# EAGLE design NodeGeneric.v1.cg2 (EAGLE 4.16)
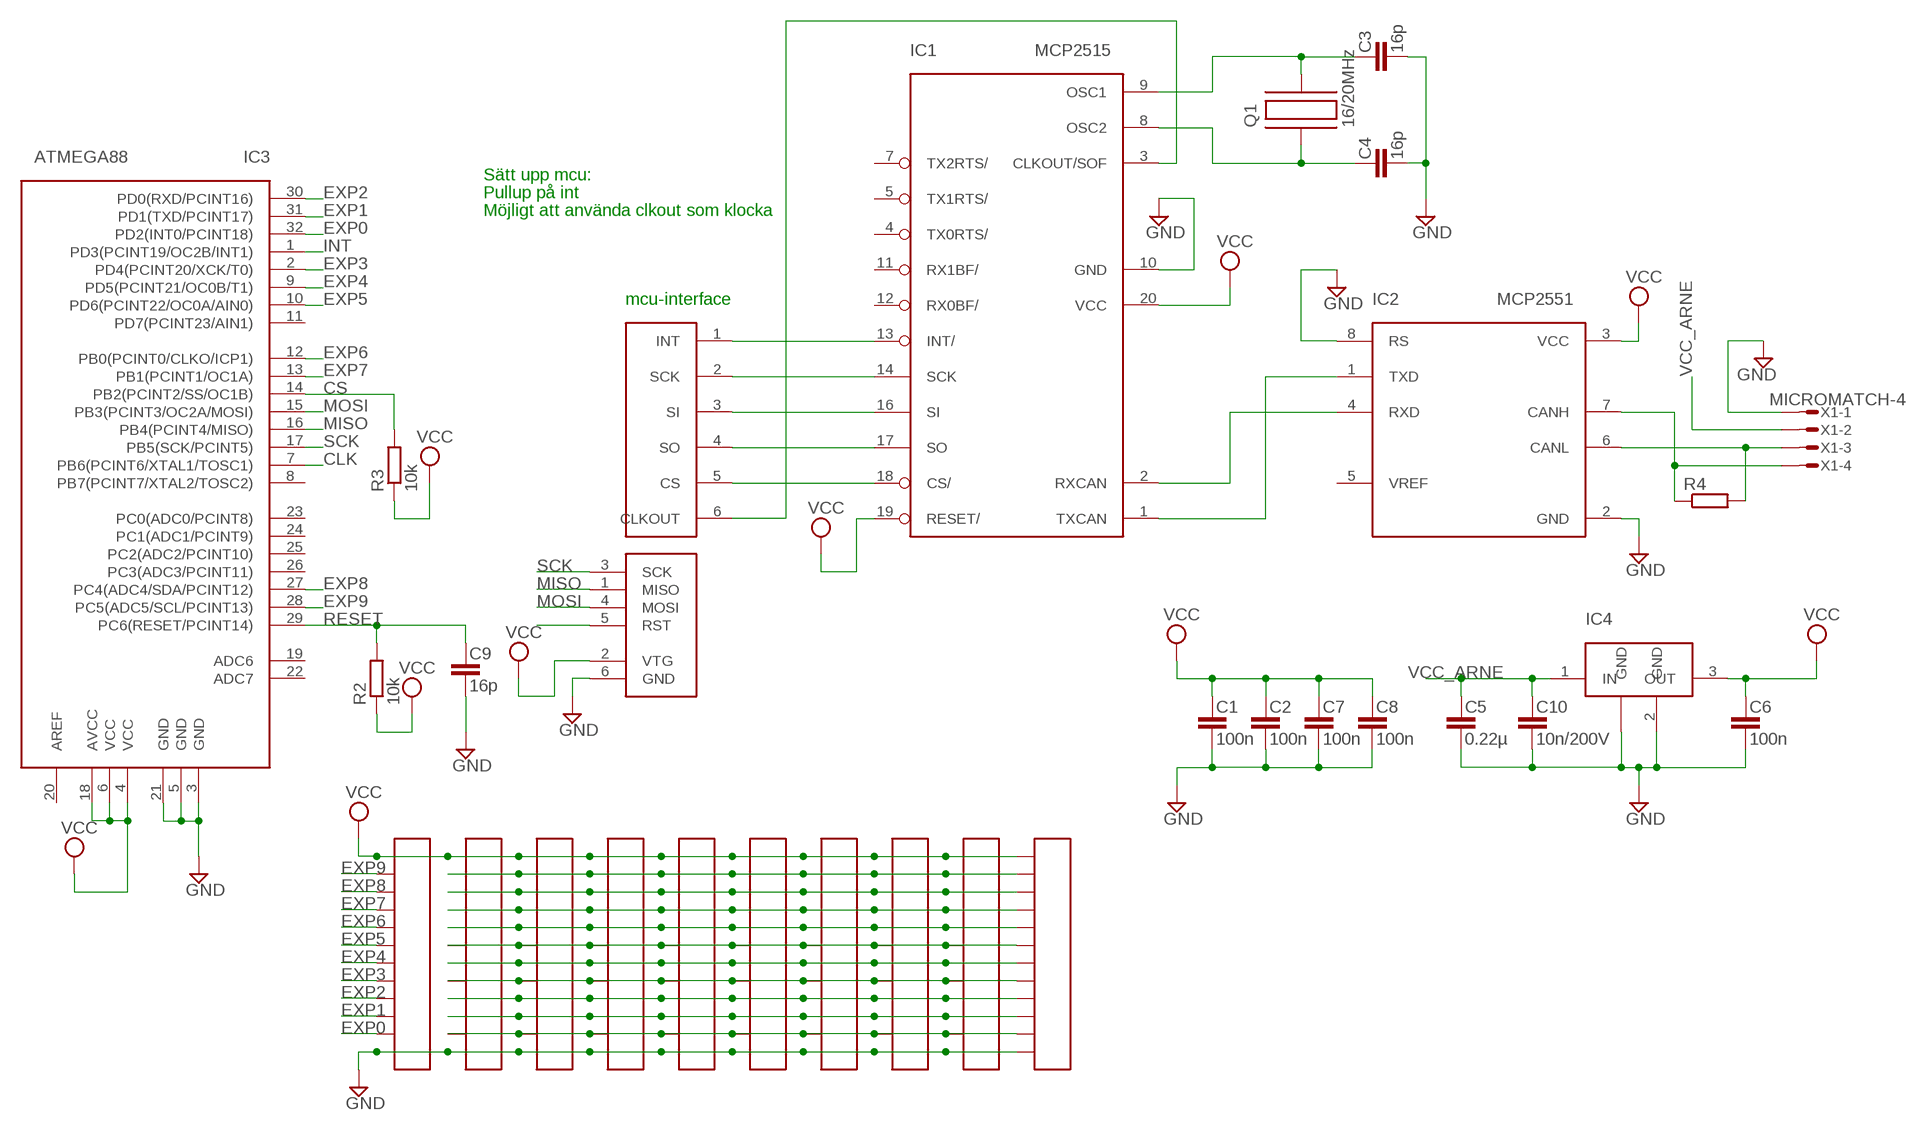
[diagram p0: schematic, sheet 1]

## Parts
C1  100n  C-EU  [C0603]
C2  100n  C-EU  [C0603]
C3  16p  C-EU  [C0603]
C4  16p  C-EU  [C0603]
C5  0.22µ  C-EU  [C0603]
C6  100n  C-EU  [C0603]
C7  100n  C-EU  [C0603]
C8  100n  C-EU  [C0603]
C9  16p  C-EU  [C0603]
C10  10n/200V  C-EU  [C0603]
IC1  MCP2515  [TSSOP]
IC2  MCP2551  [SOIC]
IC3  ATMEGA88  [TQFP32]
IC4  LM340MP-5.0  [SOT223]
Q1  16/20MHz  C-MAC-LFA147E  [SMD]
R2  10k  R-EU_R0603  [R0603@1]
R3  10k  R-EUR0603  [R0603]
R4  R-EUR0603  [R0603]
U$1  CAN-INTERFACE  [VIA-LIST]
U$3  COLUMN  [COLUMN]
U$4  COLUMN  [COLUMN]
U$5  COLUMN  [COLUMN]
U$6  COLUMN  [COLUMN]
U$7  COLUMN  [COLUMN]
U$8  COLUMN  [COLUMN]
U$9  COLUMN  [COLUMN]
U$10  COLUMN  [COLUMN]
U$11  COLUMN  [COLUMN]
U$12  COLUMN  [COLUMN]
X1  MICROMATCH-4  [MICROMATCH-4]
X2  ISP  AVRISP6PIN  [6PIN]

## Nets
CANH: IC2.7(CANH) R4.1 X1.4
CANL: IC2.6(CANL) R4.2 X1.3
CLK: IC1.3(CLKOUT/SOF) IC3.7(PB6(PCINT6/XTAL1/TOSC1)) U$1.6(CLKOUT)
CS: IC1.18(CS/) IC3.14(PB2(PCINT2/SS/OC1B)) R3.2 U$1.5(CS)
EXP0: IC3.32(PD2(INT0/PCINT18)) U$3.11
EXP1: IC3.31(PD1(TXD/PCINT17)) U$3.10
EXP2: IC3.30(PD0(RXD/PCINT16)) U$3.9
EXP3: IC3.2(PD4(PCINT20/XCK/T0)) U$3.8
EXP4: IC3.9(PD5(PCINT21/OC0B/T1)) U$3.7
EXP5: IC3.10(PD6(PCINT22/OC0A/AIN0)) U$3.6
EXP6: IC3.12(PB0(PCINT0/CLKO/ICP1)) U$3.5
EXP7: IC3.13(PB1(PCINT1/OC1A)) U$3.4
EXP8: IC3.27(PC4(ADC4/SDA/PCINT12)) U$3.3
EXP9: IC3.28(PC5(ADC5/SCL/PCINT13)) U$3.2
EXP11: U$4.11 U$5.11 U$6.11 U$7.11 U$8.11 U$9.11 U$10.11 U$11.11 U$12.11
EXP12: U$4.10 U$5.10 U$6.10 U$7.10 U$8.10 U$9.10 U$10.10 U$11.10 U$12.10
EXP13: U$4.9 U$5.9 U$6.9 U$7.9 U$8.9 U$9.9 U$10.9 U$11.9 U$12.9
EXP14: U$4.8 U$5.8 U$6.8 U$7.8 U$8.8 U$9.8 U$10.8 U$11.8 U$12.8
EXP15: U$4.7 U$5.7 U$6.7 U$7.7 U$8.7 U$9.7 U$10.7 U$11.7 U$12.7
EXP16: U$4.6 U$5.6 U$6.6 U$7.6 U$8.6 U$9.6 U$10.6 U$11.6 U$12.6
EXP17: U$4.5 U$5.5 U$6.5 U$7.5 U$8.5 U$9.5 U$10.5 U$11.5 U$12.5
EXP18: U$4.4 U$5.4 U$6.4 U$7.4 U$8.4 U$9.4 U$10.4 U$11.4 U$12.4
EXP19: U$4.3 U$5.3 U$6.3 U$7.3 U$8.3 U$9.3 U$10.3 U$11.3 U$12.3
EXP20: U$4.2 U$5.2 U$6.2 U$7.2 U$8.2 U$9.2 U$10.2 U$11.2 U$12.2
GND: C1.2 C2.2 C3.2 C4.2 C5.2 C6.2 C7.2 C8.2 C9.2 C10.2 IC1.10(GND) IC2.2(GND) IC2.8(RS) IC3.3(GND) IC3.5(GND) IC3.21(GND) IC4.2(GND) IC4.4(GND) U$3.12 U$4.12 U$5.12 U$6.12 U$7.12 U$8.12 U$9.12 U$10.12 U$11.12 U$12.12 X1.1 X2.6(GND)
INT: IC1.13(INT/) IC3.1(PD3(PCINT19/OC2B/INT1)) U$1.1(INT)
MISO: IC1.17(SO) IC3.16(PB4(PCINT4/MISO)) U$1.4(SO) X2.1(MISO)
MOSI: IC1.16(SI) IC3.15(PB3(PCINT3/OC2A/MOSI)) U$1.3(SI) X2.4(MOSI)
N$1: IC1.2(RXCAN) IC2.4(RXD)
N$2: IC1.1(TXCAN) IC2.1(TXD)
N$12: C3.1 IC1.9(OSC1) Q1.P$2
N$13: C4.1 IC1.8(OSC2) Q1.P$1
RESET: C9.1 IC3.29(PC6(RESET/PCINT14)) R2.2 X2.5(RST)
SCK: IC1.14(SCK) IC3.17(PB5(SCK/PCINT5)) U$1.2(SCK) X2.3(SCK)
VCC: C1.1 C2.1 C6.1 C7.1 C8.1 IC1.19(RESET/) IC1.20(VCC) IC2.3(VCC) IC3.4(VCC) IC3.6(VCC) IC3.18(AVCC) IC4.3(OUT) R2.1 R3.1 U$3.1 U$4.1 U$5.1 U$6.1 U$7.1 U$8.1 U$9.1 U$10.1 U$11.1 U$12.1 X2.2(VTG)
VCC_ARNE: C5.1 C10.1 IC4.1(IN) X1.2
Unconnected: IC1.4(TX0RTS/) IC1.5(TX1RTS/) IC1.7(TX2RTS/) IC1.11(RX1BF/) IC1.12(RX0BF/) IC2.5(VREF) IC3.8(PB7(PCINT7/XTAL2/TOSC2)) IC3.11(PD7(PCINT23/AIN1)) IC3.19(ADC6) IC3.20(AREF) IC3.22(ADC7) IC3.23(PC0(ADC0/PCINT8)) IC3.24(PC1(ADC1/PCINT9)) IC3.25(PC2(ADC2/PCINT10)) IC3.26(PC3(ADC3/PCINT11))

## Notes on the sheet
- Sätt upp mcu:
- Pullup på int
- Möjligt att använda clkout som klocka
- mcu-interface

## Library data of the parts
C1-C10 = rcl:C-EU
IC1 = mcp2515:MCP2515
IC2 = mcp2551:MCP2551
IC3 = atmega88:ATMEGA88
IC4 = lm340mp:LM340MP-5.0
Q1 = hc49-4h-smx:C-MAC-LFA147E
R2 = rcl:R-EU_: RESISTOR, European symbol
R3 R4 = rcl:R-EU
U$1 = can-interface:CAN-INTERFACE
U$3-U$12 = expboard:COLUMN
X1 = con-amp-micromatch:MICROMATCH-4: MicroMaTch 4 7-215464-4 / 0-215464-4 Drawing Number C-215464 DDEController.pdf
X2 = avrisp:AVRISP6PIN

## Board
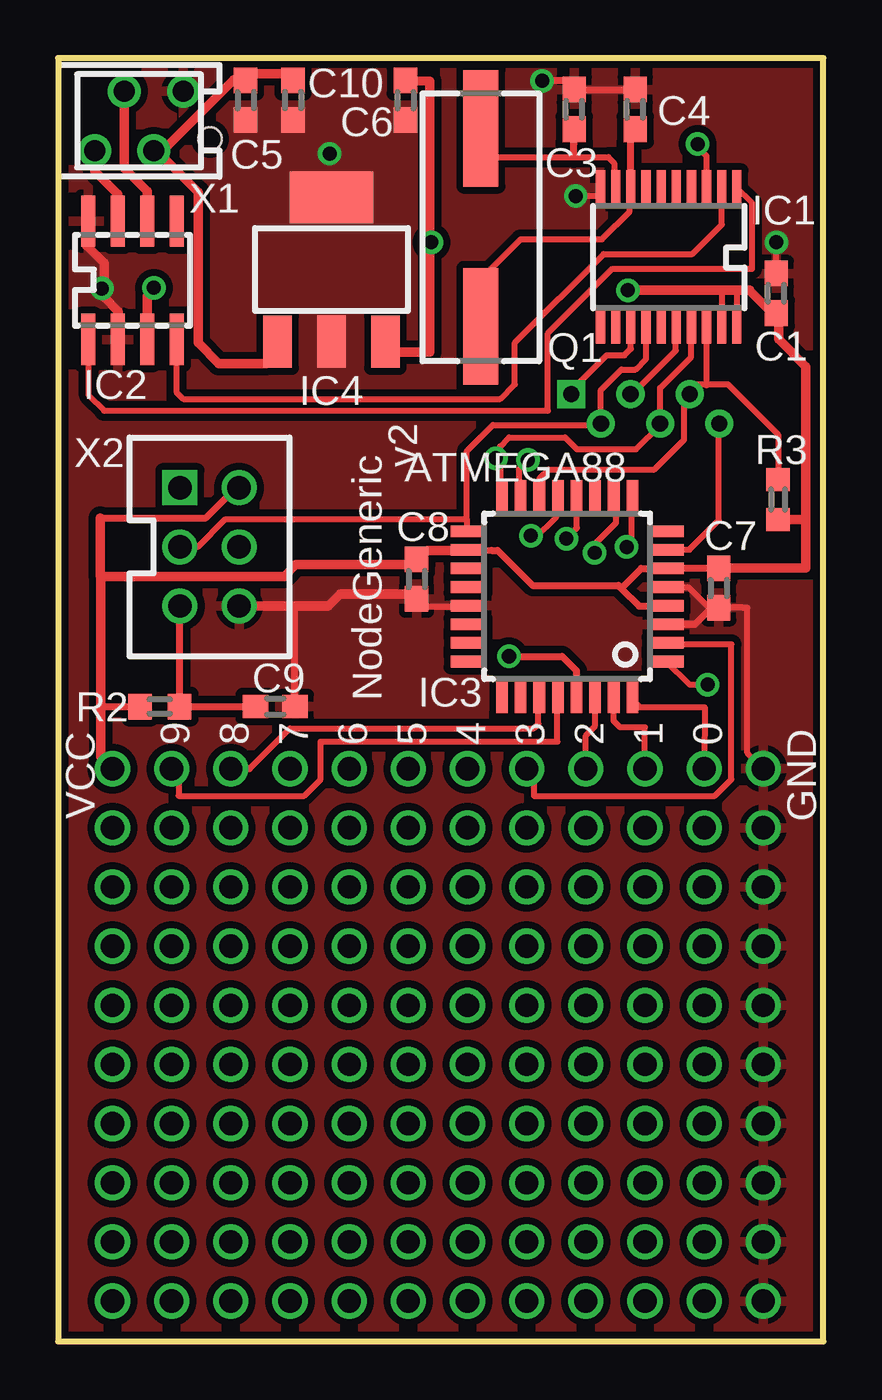
[diagram p1: board, top side]
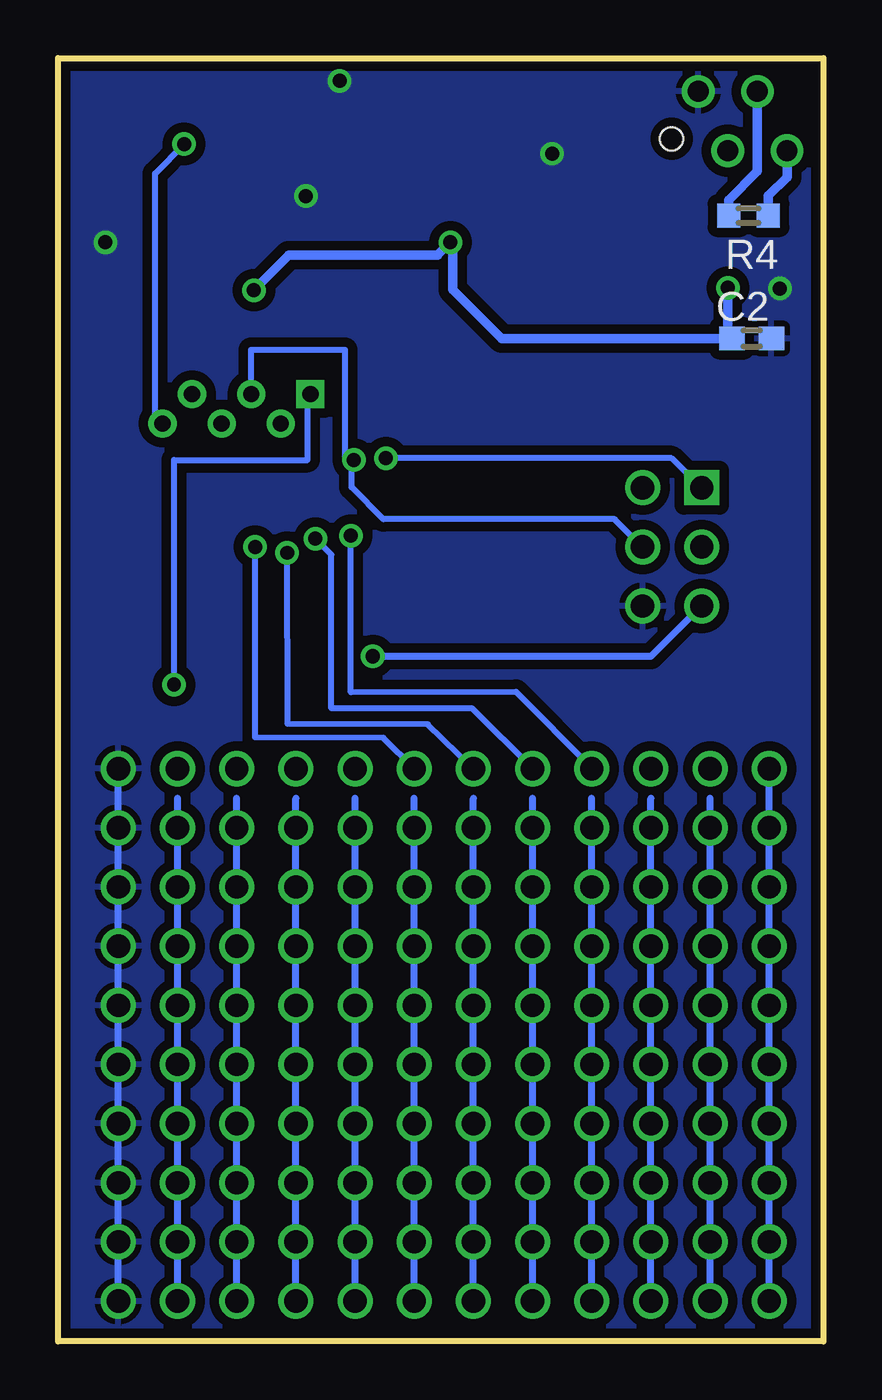
[diagram p2: board, bottom side, seen from below]

Size 32.85 x 55.1 mm. Coordinates in mm from the lower left corner, seen from the top.
Outline: 0,0 32.85,0 32.85,55.1 0,55.1 0,0
Copper layers (1*16): Top 0.035mm / dielectric 1.5mm / Bottom 0.035mm
Design rules "10mils, 0.6drill": minimum track width 10mil, minimum drill 0.6mm, track to track 10mil, track to pad 10mil, pad to pad 10mil, via to via 10mil, smd to smd 10mil, copper to edge 10mil, drill to drill 10mil, minimum pad ring 10mil, minimum via ring 8mil, stop-mask expansion 0mil, vias tented up to drill 0mil, thermal gap 10mil

### Footprints (pad centres in the part's own frame; a part is rotated, then mirrored left to right if it is on the bottom)
C0603 = smd 1.1 x 1: 1 -0.85,0; 2 0.85,0
TSSOP = smd 0.396 x 1.5: 1 -2.925,-2.975; 2 -2.275,-2.975; 3 -1.625,-2.975; 4 -0.975,-2.975; 5 -0.325,-2.975; 6 0.325,-2.975; 7 0.975,-2.975; 8 1.625,-2.975; 9 2.275,-2.975; 10 2.925,-2.975; 11 2.925,2.975; 12 2.275,2.975; 13 1.625,2.975; 14 0.975,2.975; 15 0.325,2.975; 16 -0.325,2.975; 17 -0.975,2.975; 18 -1.625,2.975; 19 -2.275,2.975; 20 -2.925,2.975
SOIC = smd 0.6 x 2.2: 1 -1.905,-2.54; 2 -0.635,-2.54; 3 0.635,-2.54; 4 1.905,-2.54; 5 1.905,2.54; 6 0.635,2.54; 7 -0.635,2.54; 8 -1.905,2.54
TQFP32 = smd 1.5 x 0.5: 1 -4.25,2.65; 2 -4.25,1.85; 3 -4.25,1.05; 4 -4.25,0.25; 5 -4.25,-0.55; 6 -4.25,-1.35; 7 -4.25,-2.15; 8 -4.25,-2.95; 17 4.25,-2.95; 18 4.25,-2.15; 19 4.25,-1.35; 20 4.25,-0.55; 21 4.25,0.25; 22 4.25,1.05; 23 4.25,1.85; 24 4.25,2.65 | smd 0.5 x 1.5: 9 -2.8,-4.4; 10 -2,-4.4; 11 -1.2,-4.4; 12 -0.4,-4.4; 13 0.4,-4.4; 14 1.2,-4.4; 15 2,-4.4; 16 2.8,-4.4; 25 2.8,4.1; 26 2,4.1; 27 1.2,4.1; 28 0.4,4.1; 29 -0.4,4.1; 30 -1.2,4.1; 31 -2,4.1; 32 -2.8,4.1
SOT223 = smd 1.219 x 2.235: 1 -2.311,-3.099; 2 0,-3.099; 3 2.311,-3.099 | smd 3.6 x 2.2: 4 0,3.099
SMD = smd 5 x 1.5: P$1 4.25,0; P$2 -4.25,0
R0603@1 = smd 1 x 1.1: 1 -0.85,0; 2 0.85,0
R0603 = smd 0.991 x 1.016: 1 -0.85,0; 2 0.85,0
VIA-LIST = drill 0.7 square: 1 0,2.54 | drill 0.7 round: 2 -1.27,1.27; 3 0,0; 4 -1.27,-1.27; 5 0,-2.54; 6 -1.27,-3.81
COLUMN12SIMPLE = drill 1 round: 1 0,15.24; 2 0,12.7; 3 0,10.16; 4 0,7.62; 5 0,5.08; 6 0,2.54; 7 0,0; 8 0,-2.54; 9 0,-5.08; 10 0,-7.62; 11 0,-10.16; 12 0,-12.7
COLUMN = drill 1 round: 1 0,15.24; 2 0,12.7; 3 0,10.16; 4 0,7.62; 5 0,5.08; 6 0,2.54; 7 0,0; 8 0,-2.54; 9 0,-5.08; 10 0,-7.62; 11 0,-10.16; 12 0,-12.7
MICROMATCH-4 = drill 0.9 round: 1 1.905,1.27; 2 0.635,-1.27; 3 -0.635,1.27; 4 -1.905,-1.27 | hole 1: 3.048,-0.762
6PIN = drill 1 square: 1 -1.27,2.54 | drill 1 round: 2 1.27,2.54; 3 -1.27,0; 4 1.27,0; 5 -1.27,-2.54; 6 1.27,-2.54

### Placement (x,y rotation side)
C1  30.82,45 90 top
C2  3.08,43.06 0 bottom
C3  22.15,52.9 90 top
C4  24.77,52.9 90 top
C5  8.04,53.29 270 top
C6  14.9,53.29 270 top
C7  28.35,32.35 270 top
C8  15.38,32.73 270 top
C9  9.31,27.26 0 top
C10  10.07,53.29 270 top
IC1  26.21,46.56 180 top
IC2  3.18,45.56 0 top
IC3  21.85,31.84 180 top
IC4  11.73,46.02 0 top
Q1  18.14,47.84 270 top
R2  4.36,27.26 0 top
R3  30.9,36.15 90 top
R4  3.22,48.34 180 bottom
U$1  24.57,40.68 90 top
U$3  COLUMN  [COLUMN12SIMPLE]  17.57,24.59 90 top
U$4  17.57,1.73 90 top
U$5  17.57,4.27 90 top
U$6  17.57,6.81 90 top
U$7  17.57,9.35 90 top
U$8  17.57,11.89 90 top
U$9  17.57,14.43 90 top
U$10  17.57,16.97 90 top
U$11  17.57,19.51 90 top
U$12  17.57,22.05 90 top
X1  3.47,52.4 0 top
X2  6.49,34.11 0 top

### Tracks (layer width: path | path; a pad name or v marks a point on that pad's centre or on a via)
CANH
  Top 0.406: IC2.7 2.55,49.26 1.57,50.24 X1.4
  Bottom 0.406: R4.1 2.37,49.19 1.57,49.99 X1.4
CANL
  Top 0.406: IC2.6 3.82,49.39 2.84,50.37 X1.3
  Bottom 0.406: R4.2 4.07,49.01 2.84,50.24 X1.3
CLK  (via drill 0.6)
  Top 0.254: IC3.7 27.1,33.99 28.36,35.26 28.36,39.32 28.37,39.33 U$1.6 | IC1.3 27.83,50.9 27.47,51.26 27.47,51.39 v27.45,51.41
  Bottom 0.254: v27.45,51.41 28.69,50.14 28.69,39.62 28.59,39.62 U$1.6
CS
  Top 0.254: 27.83,41.1 27.83,41.06 | 27.83,41.1 27.83,43.71 | IC3.14 20.67,36.6 20.67,37.06 21.05,37.44 25.59,37.44 26.86,38.71 26.86,40.74 27.11,40.98 U$1.5 27.09,41.06 27.09,41.1 27.83,41.1 | R3.2 30.9,38.94 28.74,41.1 27.83,41.1
  Top 0.305: 27.86,43.51 27.83,43.54 | 27.83,43.54 IC1.18 | 27.83,43.71 27.83,43.54
EXP0
  Top 0.254: U$3.11 27.73,24.72 27.75,27.23 24.96,27.23 24.68,27.51 IC3.32
EXP1
  Top 0.254: IC3.31 23.85,26.64 24.12,26.37 25.19,26.37 U$3.10
EXP2
  Top 0.254: IC3.30 23.05,26.43 22.65,26.01 U$3.9
EXP3
  Top 0.254: IC3.2 26.48,29.92 28.9,29.92 28.9,24.13 28.18,23.42 20.41,23.42 20.41,23.88 U$3.8
EXP4  (via drill 0.6)
  Top 0.254: v24.4,34.11 24.63,34.22 24.63,35.84 IC3.9
  Bottom 0.254: v24.4,34.11 24.4,25.93 18.89,25.91 U$3.7
EXP5  (via drill 0.6)
  Top 0.254: v23.03,33.86 23.03,34.24 23.94,35.15 23.94,36.22 IC3.10
  Bottom 0.254: v23.03,33.86 23,26.52 16.98,26.49 U$3.6
EXP6  (via drill 0.6)
  Top 0.254: IC3.12 22.27,36.22 22.27,34.93 v21.81,34.47
  Bottom 0.254: v21.81,34.47 21.12,33.78 21.12,27.18 15.08,27.18 U$3.5
EXP7  (via drill 0.6)
  Top 0.254: v20.29,34.6 20.46,34.47 21.38,35.38 21.38,36.15 21.45,36.21 IC3.13
  Bottom 0.254: v20.29,34.6 20.29,27.87 13.2,27.89 9.97,24.64 9.9,24.61 U$3.4
EXP8
  Top 0.254: 8.22,24.59 9.95,26.32 20.41,26.32 20.62,26.52 20.62,27.08 20.67,27.13 20.65,27.15 IC3.27
  Top 0.305: U$3.3 8.22,24.59
EXP9
  Top 0.254: U$3.2 5.17,23.88 5.17,23.42 10.56,23.42 11.27,24.13 11.27,25.76 21.43,25.76 21.43,27.23 IC3.28
EXP11
  Bottom 0.305: U$4.11 U$5.11 U$6.11 U$7.11 U$8.11 U$9.11 U$10.11 U$11.11 U$12.11 27.73,23.32
EXP12
  Bottom 0.305: U$4.10 U$5.10 U$6.10 U$7.10 U$8.10 U$9.10 U$10.10 U$11.10 U$12.10 25.19,23.32
EXP13
  Bottom 0.305: U$4.9 U$5.9 U$6.9 U$7.9 U$8.9 U$9.9 U$10.9 U$11.9 U$12.9 22.65,23.32
EXP14
  Bottom 0.305: U$4.8 U$5.8 U$6.8 U$7.8 U$8.8 U$9.8 U$10.8 U$11.8 U$12.8 20.11,23.32
EXP15
  Bottom 0.305: U$4.7 U$5.7 U$6.7 U$7.7 U$8.7 U$9.7 U$10.7 U$11.7 U$12.7 17.57,23.32
EXP16
  Bottom 0.305: U$4.6 U$5.6 U$6.6 U$7.6 U$8.6 U$9.6 U$10.6 U$11.6 U$12.6 15.03,23.32
EXP17
  Bottom 0.305: U$4.5 U$5.5 U$6.5 U$7.5 U$8.5 U$9.5 U$10.5 U$11.5 U$12.5 12.49,23.32
EXP18
  Bottom 0.305: U$4.4 U$5.4 U$6.4 U$7.4 U$8.4 U$9.4 U$10.4 U$11.4 U$12.4 9.95,23.32
EXP19
  Bottom 0.305: U$4.3 U$5.3 U$6.3 U$7.3 U$8.3 U$9.3 U$10.3 U$11.3 U$12.3 7.41,23.32
EXP20
  Bottom 0.305: U$4.2 U$5.2 U$6.2 U$7.2 U$8.2 U$9.2 U$10.2 U$11.2 U$12.2 4.87,23.32
GND  (via drill 0.6)
  Top 0.254: v22.22,49.18 23.16,49.18 IC1.10 | v30.83,47.19 30.83,46.33 C1.2 | 1.97,44.83 v1.87,45.21 | C8.2 15.59,31.55 17.24,31.55 IC3.21 17.95,31.57 | 25.72,32.44 IC3.5 26.36,32.36 27.07,32.36 27.98,31.45 28.1,31.45 28.23,31.46 | 28.05,31.37 C7.2 29.4,31.5 29.58,31.5 29.58,25.27 U$3.12
  Top 0.305: IC2.2 2.58,43.36 | C4.2 C3.2 22.15,54.13 v20.77,54.13 | C7.2 28.23,31.46 28.1,31.46 27.98,31.45 27.32,30.79 IC3.3 | C9.2 10.16,31.53 10.2,31.57
  Top 0.406: 2.58,43.36 2.58,44.22 1.97,44.83 1.97,46.3 1.21,47.07 IC2.8 | C8.2 15.38,32.05 15.54,32.08 12.11,32.08 11.6,31.57 10.2,31.57 X2.6
  Bottom 0.305: v20.77,54.13 20.72,54.08 | U$4.12 U$5.12 U$6.12 U$7.12 U$8.12 U$9.12 U$10.12 U$11.12 U$12.12 U$3.12
  other vias: 11.65,51
  pour Bottom (isolate 0.406): 0.12,54.99 32.83,54.99 32.83,0.1 24.38,0.1 0.12,0.1
  pour Top (isolate 0.305, no thermals): 6.06,54.5 15.89,54.5 15.89,41.06 6.06,41.06
  pour Top (isolate 0.305): 0.17,54.94 32.68,54.94 32.68,0.08 0.17,0.08
INT  (via drill 0.6)
  Top 0.254: v27.88,28.2 27.12,28.2 IC3.1 | IC1.13 24.58,42.62 24.3,42.34 23.54,42.34 22.25,41.06 U$1.1 22.01,41.07 22.01,41.1
  Bottom 0.254: v27.88,28.2 27.88,37.85 22.14,37.85 22.14,40.97 22.01,40.97 | 22.01,40.97 22.02,40.98 | 22.01,41.07 22.01,41.1 | 22.01,41.07 U$1.1 | 22.01,40.97 22.01,41.07
MISO  (via drill 0.6)
  Top 0.254: IC3.16 18.96,36.55 18.96,37.75 | v18.79,37.92 18.96,37.75 | U$1.4 25.84,39.71 | 25.84,39.71 25.84,40.93 27.17,42.27 27.17,43.64 27.18,43.65 IC1.17 | 25.82,39.8 25.82,39.73 25.84,39.71 | U$1.4 25.82,39.8 | 25.82,39.8 25.82,39.83 | 18.96,37.75 18.96,38.43 19.35,38.81 21.76,38.81 22.27,38.3 24.81,38.3 25.84,39.33 U$1.4
  Bottom 0.254: 5.12,36.65 X2.1 5.25,36.65 6.52,37.92 v18.79,37.92
MOSI  (via drill 0.6)
  Top 0.254: v20.16,37.85 19.78,37.44 19.78,36.6 IC3.15 | U$1.3 24.64,40.68 26.51,42.55 26.51,43.69 26.53,43.71 IC1.16
  Bottom 0.254: X2.4 7.79,34.11 8.96,35.28 8.96,35.31 18.89,35.31 20.26,36.68 20.26,37.69 v20.16,37.85 20.54,37.97 20.54,42.57 24.58,42.57 24.58,41.12 24.55,41.1 24.56,41.09 U$1.3
N$1
  Top 0.254: IC2.4 5.12,43 5.07,42.95 5.07,40.77 5.38,40.46 18.96,40.46 19.6,41.1 19.6,42.88 23.41,46.69 27.22,46.69 28.49,47.96 28.49,49.48 28.48,49.49 IC1.2
N$2
  Top 0.254: IC1.1 29.79,48.89 29.79,46.05 23.79,46.05 21.02,43.28 21.02,39.95 1.97,39.95 1.31,40.62 1.31,43 1.3,43 IC2.1
N$12
  Top 0.254: IC1.9 23.87,49.89 23.87,50.6 23.61,50.85 22.14,50.85 18.51,50.85 Q1.P$2
  Top 0.305: C3.1 22.14,51.42 22.14,50.85
N$13
  Top 0.254: IC1.8 24.53,48.92 24.53,48.52 23.33,47.32 19.85,47.32 17.95,45.42 Q1.P$1
  Top 0.305: IC1.8 24.58,49.41 24.58,51.86 C4.1
RESET  (via drill 0.61)
  Top 0.254: X2.5 5.22,31.47 5.25,31.45 5.22,31.42 5.22,30.92
  Top 0.305: C9.1 R2.2 5.21,31.36 5.15,31.42 | 5.15,31.42 5.12,31.45 | 5.15,31.42 5.22,31.42 | IC3.29 22.25,28.8 21.63,29.41 v19.35,29.41
  Bottom 0.305: X2.5 5.25,31.57 7.41,29.41 v19.35,29.41
SCK
  Top 0.254: 17.54,35.31 17.54,34.98 IC3.17 | 17.54,35.31 17.54,38.23 18.66,39.34 22.93,39.34 23.29,39.71 23.28,39.73 23.28,39.8 | 17.54,35.31 7.18,35.31 5.99,34.11 5.63,34.14 5.27,34.14 5.25,34.11 X2.3 | IC1.14 25.23,43.68 25.19,43.64 IC1.14 25.24,42.19 24.78,41.73 24.17,41.73 23.29,40.86 U$1.2 23.28,39.8 | 23.28,39.8 23.28,39.83
VCC  (via drill 0.6)
  Top 0.254: 29.15,43.69 29.13,43.71 29.13,45.03 29.12,45.04 29.12,45.14 | C8.1 15.84,33.96 | 26.48,33.2 IC3.6 25.72,33.2 | U$3.1 2.33,24.84 | 2.33,24.84 2.33,24.99 | 7.46,36.48 7.59,36.48 | 2.33,24.84 2.28,24.84 | 28.48,43.65 28.49,43.64 | 28.48,43.65 IC1.19 | 28.49,45.14 28.49,45.04 28.48,45.03 28.48,43.65
  Top 0.305: 17.24,33.96 IC3.18 18.61,33.96 18.86,33.96 20.36,32.46 24.04,32.46 24.17,32.34 | 26.48,33.2 27.5,33.2 C7.1 | C8.1 15.69,33.48 15.69,33.35 | 7.59,36.48 X2.2 | 7.46,36.48 6.34,35.36 1.79,35.36 | 24.17,32.34 24.93,31.57 25.82,31.57 25.84,31.59 IC3.4 | IC3.6 25.03,33.19 24.17,32.34 | 1.82,27.26 R2.1 | 29.13,43.52 IC1.20 | 29.13,43.71 29.13,43.52 | 29.13,43.52 29.12,43.51
  Top 0.406: C6.1 15.95,54.11 15.95,47.19 | 15.95,47.19 15.95,42.48 14.08,42.48 14.08,43.18 IC4.3 | v16.02,47.19 15.95,47.19 | v24.45,45.14 28.49,45.14 29.12,45.14 29.68,45.14 29.68,45.11 30.65,44.15 C1.1 30.9,44.15 30.93,44.12 30.93,43.03 32.1,41.86 32.1,35.26 | 15.84,33.96 17.24,33.96 | C7.1 28.08,33.2 32.1,33.2 32.1,35.26 | 1.82,32.84 9.69,32.84 10.2,33.35 15.69,33.35 | 1.82,32.84 1.82,27.26 1.82,25.1 U$3.1 | 1.79,35.36 1.79,32.87 1.82,32.84 | 32.1,35.26 32.05,35.26 32.05,35.3 R3.1 | v4.11,45.24 4.11,45.16 3.82,44.88 IC2.3
  Bottom 0.254: C2.1 4.11,43.56
  Bottom 0.305: 16.55,46.64 16.55,46.66 | U$4.1 U$5.1 U$6.1 U$7.1 U$8.1 U$9.1 U$10.1 U$11.1 U$12.1 U$3.1
  Bottom 0.406: 4.11,43.56 v4.11,45.24 | 16.55,46.66 v16.02,47.19 16.04,47.19 15.92,47.07 15.92,45.16 13.82,43.06 C2.1 | 16.55,46.64 22.95,46.64 v24.45,45.14
VCC_ARNE
  Top 0.305: 8.09,54.36 8.07,54.17 C5.1 | IC4.1 9.31,42.92
  Top 0.406: C10.1 10.07,54.43 8.17,54.43 8.17,54.17 | 8.04,54.18 8.17,54.17 | 8.17,54.17 8.07,54.17 | 4.49,51.13 X1.2 | 4.49,51.13 7.54,54.18 8.04,54.18 | 8.04,54.18 C5.1 | 4.49,51.13 4.49,50.88 6.01,49.35 6.01,42.88 6.9,41.99 8.93,41.99 9.44,42.5 9.42,42.52 IC4.1

### Text on the board
tPlace: v2 | NodeGeneric | 9 | 8 | 7 | 6 | 5 | 4 | 3 | 2 | 1 | 0 | VCC | GND